# Altium schematic sheet SCH_ESPHome Fan.schdoc
size 284 x 168 mm
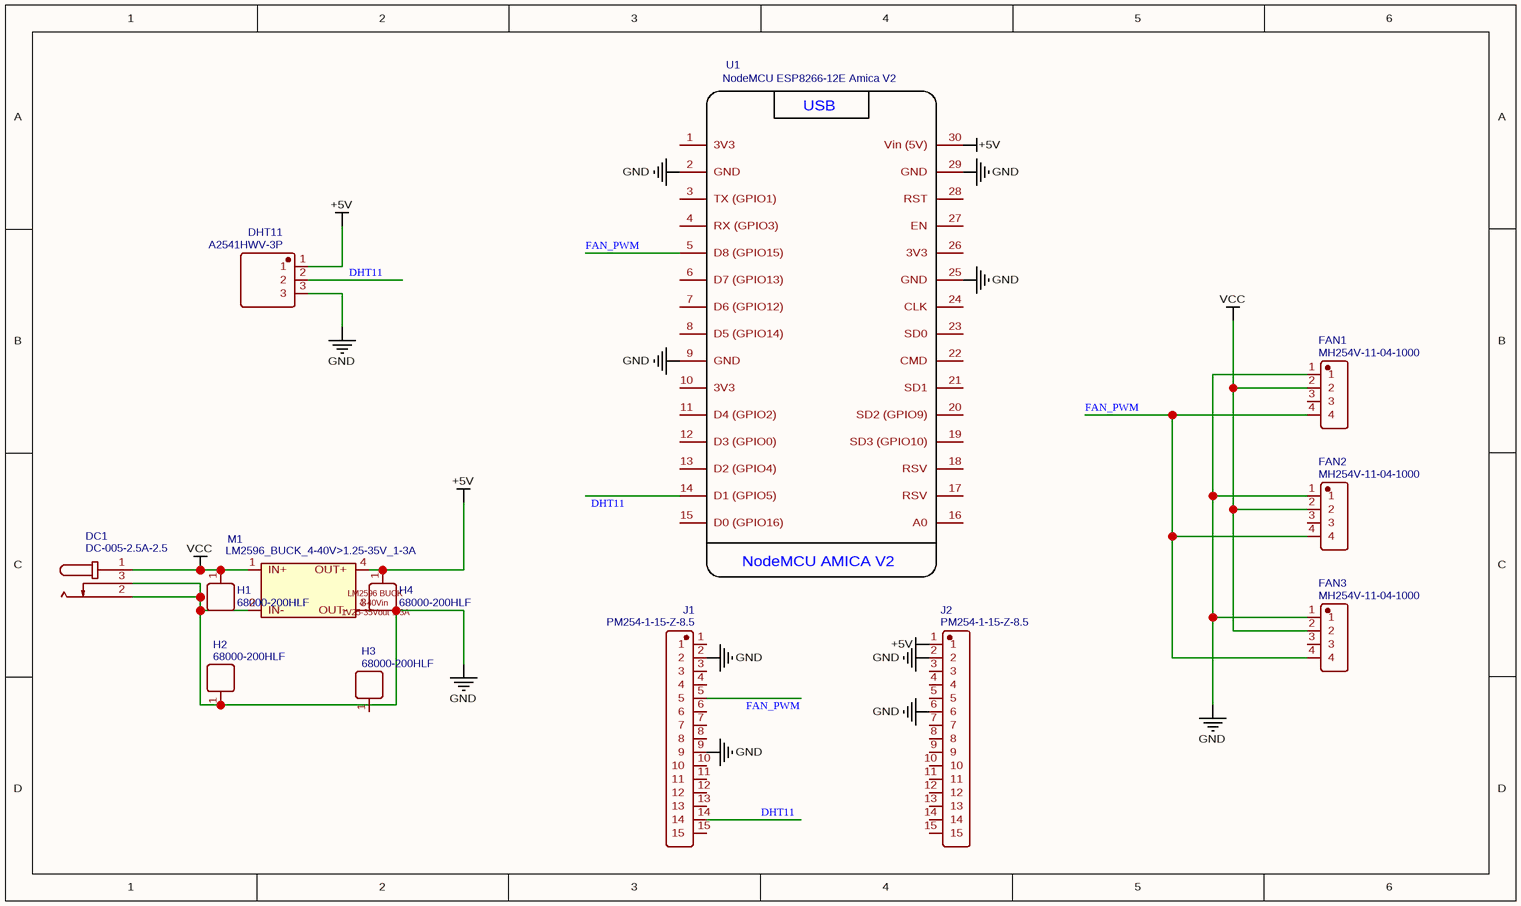
[diagram p0: SCH_ESPHome Fan.schdoc]

## Parts
DC1  DC-005-2.5A-2.5  [CONN-TH_DC-005-2.5A-2.0]
DHT11  A2541HWV-3P  [HDR-TH_3P-P2.54-V-F-1]
FAN1  MH254V-11-04-1000  [HDR-TH_4P-P2.54-V-M-3]
FAN2  MH254V-11-04-1000  [HDR-TH_4P-P2.54-V-M-3]
FAN3  MH254V-11-04-1000  [HDR-TH_4P-P2.54-V-M-3]
H1  68000-200HLF  [HDR-TH_1P-P2.54-V-M]
H2  68000-200HLF  [HDR-TH_1P-P2.54-V-M]
H3  68000-200HLF  [HDR-TH_1P-P2.54-V-M]
H4  68000-200HLF  [HDR-TH_1P-P2.54-V-M]
J1  PM254-1-15-Z-8.5  [HDR-TH_15P-P2.54-V-F]
J2  PM254-1-15-Z-8.5  [HDR-TH_15P-P2.54-V-F]
M1  LM2596_BUCK_4-40V>1.25-35V_1-3A  [DC-DC BUCK LM2596]
U1  NodeMCU ESP8266-12E Amica V2  [MY_NODEMCU ESP8266-12E AMICA V2]

## Nets
+5V: DHT11.1 H4.1 J2.1 M1.4(OUT+) U1.30(Vin_(5V))
GND: DC1.2 DC1.3 DHT11.3 FAN1.1 FAN2.1 FAN3.1 H2.1 J1.2 J1.9 J2.2 J2.6 M1.2(IN-) M1.3(OUT-) U1.2(GND) U1.9(GND) U1.25(GND) U1.29(GND)
VCC: DC1.1 FAN1.2 FAN2.2 FAN3.2 H1.1 M1.1(IN+)
DHT11: DHT11.2 J1.14 U1.14(D1_(GPIO5))
FAN_PWM: FAN1.4 FAN2.4 FAN3.4 J1.5 U1.5(D8_(GPIO15))

Not connected (* = marked no-connect by the designer): FAN1 3; FAN2 3; FAN3 3; H3 1; J1 1 3 4 6 7 8 10 11 12 13 15; J2 3 4 5 7 8 9 10 11 12 13 14 15; U1 1(3V3) 3(TX_(GPIO1)) 4(RX_(GPIO3)) 6(D7_(GPIO13)) 7(D6_(GPIO12)) 8(D5_(GPIO14)) 10(3V3) 11(D4_(GPIO2)) 12(D3_(GPIO0)) 13(D2_(GPIO4)) 15(D0_(GPIO16)) 16(A0) 17(RSV) 18(RSV) 19(SD3_(GPIO10)) 20(SD2_(GPIO9)) 21(SD1) 22(CMD) 23(SD0) 24(CLK) 26(3V3) 27(EN) 28(RST)

## Notes on the sheet
- (in symbol LM2596_BUCK_4-40V>1.25-35V_1-3A) LM2596 BUCK / 4-40Vin / 1V25-35Vout 1-3A
- (in symbol NodeMCU ESP8266-12E Amica V2) USB; NodeMCU AMICA V2

## Library data of the parts
DC1 = DC-005-2.5A-2.5: BOM_Manufacturer: XKB Enterprise; Contributor: LCSC; BOM_Supplier: LCSC; BOM_Supplier Part: C319098; BOM_Manufacturer Part: DC-005-2.5A-2.5; BOM_JLCPCB Part Class: Extended Part; spicePre: D; spiceSymbolName: DC-005-2.5A-2.5
DHT11 = A2541HWV-3P: BOM_Manufacturer: CJT(长江连接器); Contributor: LCSC; BOM_Supplier: LCSC; BOM_Supplier Part: C225500; BOM_Manufacturer Part: A2541HWV-3P; BOM_JLCPCB Part Class: Extended Part; spicePre: H; spiceSymbolName: A2541HWV-3P
FAN1-FAN3 = MH254V-11-04-1000: BOM_Manufacturer: XFCN(兴飞); Contributor: LCSC; BOM_Supplier: LCSC; BOM_Supplier Part: C509261; BOM_Manufacturer Part: MH254V-11-04-1000; BOM_JLCPCB Part Class: Extended Part; spicePre: H; spiceSymbolName: MH254V-11-04-1000
H1-H4 = 68000-200HLF: BOM_Manufacturer: Amphenol; Contributor: LCSC; BOM_Supplier: LCSC; BOM_Supplier Part: C213187; BOM_Manufacturer Part: 68000-200HLF; BOM_JLCPCB Part Class: Extended Part; spicePre: H; spiceSymbolName: 68000-200HLF
J1 J2 = PM254-1-15-Z-8.5: BOM_Manufacturer: HCTL(华灿天禄); Contributor: LCSC; BOM_Supplier: LCSC; BOM_Supplier Part: C2897378; BOM_Manufacturer Part: PM254-1-15-Z-8.5; BOM_JLCPCB Part Class: Extended Part; spicePre: U; spiceSymbolName: PM254-1-15-Z-8.5
M1 = LM2596_BUCK_4-40V>1.25-35V_1-3A: Contributor: scalak_s; spicePre: ?; spiceSymbolName: LM2596_BUCK_4-40V>1.25-35V_1-3A
U1 = NodeMCU ESP8266-12E Amica V2: Contributor: irukard; sourceId: c4ASM4mEW; Author: Krzysztof Daszuta; timeStamp: 1474282571; BOM_Supplier Part: nodemcu-v2; BOM_Supplier: Nettigo; spicePre: U; spiceSymbolName: NodeMCU ESP8266-12E Amica V2